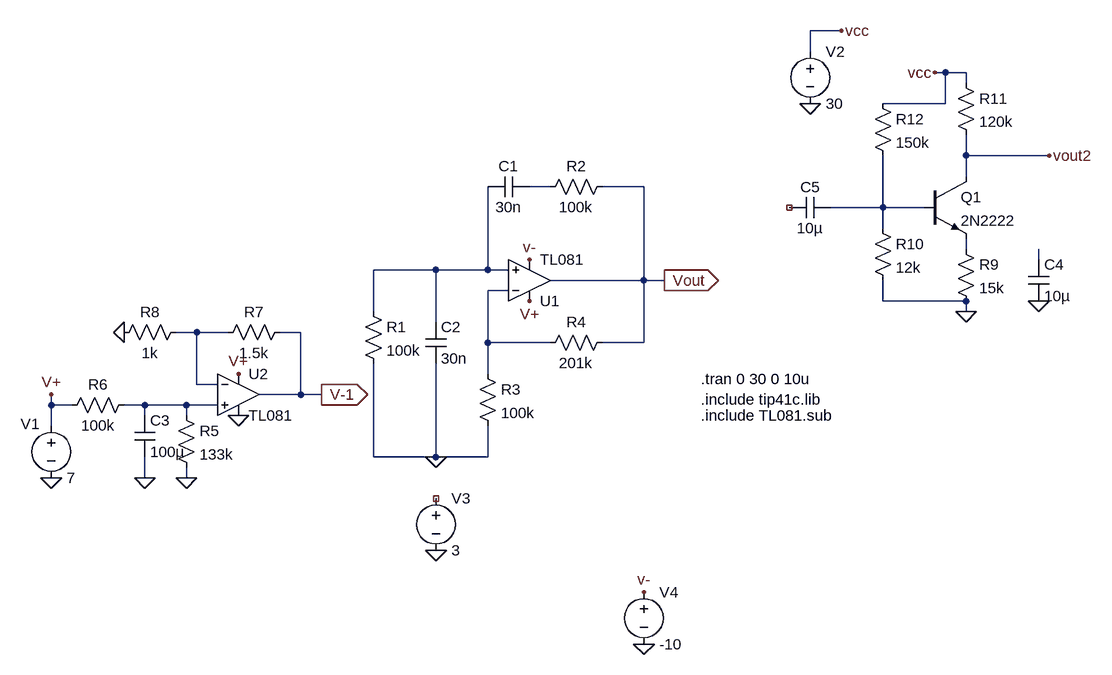
[diagram p0: schematic vib3_wein_bridge.asc]
vib3_wein_bridge.asc, the LTspice schematic file:
Version 4
SHEET 1 1540 680
WIRE 736 -512 688 -512
WIRE 688 -480 688 -512
WIRE 896 -448 880 -448
WIRE 928 -448 896 -448
WIRE 928 -432 928 -448
WIRE 896 -400 896 -448
WIRE 896 -400 800 -400
WIRE 928 -320 928 -352
WIRE 1056 -320 928 -320
WIRE 928 -288 928 -320
WIRE 288 -272 256 -272
WIRE 432 -272 368 -272
WIRE 800 -240 800 -320
WIRE 800 -240 720 -240
WIRE 864 -240 800 -240
WIRE 800 -208 800 -240
WIRE 928 -176 928 -192
WIRE 1040 -160 1040 -176
WIRE 112 -144 16 -144
WIRE 192 -144 192 -272
WIRE 192 -144 112 -144
WIRE 224 -144 192 -144
WIRE 432 -128 432 -272
WIRE 432 -128 288 -128
WIRE 464 -128 432 -128
WIRE 224 -112 192 -112
WIRE 800 -96 800 -128
WIRE 928 -96 800 -96
WIRE 16 -80 16 -144
WIRE 928 -80 928 -96
WIRE 112 -64 112 -144
WIRE -256 -48 -288 -48
WIRE -208 -48 -256 -48
WIRE -96 -48 -128 -48
WIRE 192 -32 192 -112
WIRE 288 -32 192 -32
WIRE 432 -32 432 -128
WIRE 432 -32 368 -32
WIRE 192 16 192 -32
WIRE -256 32 -256 -48
WIRE -224 32 -256 32
WIRE -96 48 -96 -48
WIRE -96 48 -160 48
WIRE -64 48 -96 48
WIRE -480 64 -480 48
WIRE -448 64 -480 64
WIRE -336 64 -368 64
WIRE -272 64 -336 64
WIRE -224 64 -272 64
WIRE -336 80 -336 64
WIRE -272 80 -272 64
WIRE -480 96 -480 64
WIRE 16 144 16 0
WIRE 112 144 112 0
WIRE 112 144 16 144
WIRE 192 144 192 96
WIRE 192 144 112 144
WIRE -336 176 -336 144
WIRE -272 176 -272 160
FLAG 464 -128 Vout
IOPIN 464 -128 Out
FLAG -480 48 V+
FLAG 256 -96 V+
FLAG -480 176 0
FLAG -272 176 0
FLAG 112 288 0
FLAG -64 48 V-1
IOPIN -64 48 Out
FLAG -192 16 V+
FLAG -192 80 0
FLAG -336 176 0
FLAG -368 -48 0
FLAG 688 -400 0
FLAG 736 -512 vcc
FLAG 880 -448 vcc
FLAG 928 -80 0
FLAG 1056 -320 vout2
FLAG 1040 -96 0
FLAG 432 432 0
FLAG 432 352 v-
FLAG 256 -160 v-
FLAG 112 144 0
SYMBOL res 0 -96 R0
SYMATTR InstName R1
SYMATTR Value 100k
SYMBOL res 384 -288 R90
WINDOW 0 0 56 VBottom 2
WINDOW 3 32 56 VTop 2
SYMATTR InstName R2
SYMATTR Value 100k
SYMBOL cap 256 -288 R90
WINDOW 0 0 32 VBottom 2
WINDOW 3 32 32 VTop 2
SYMATTR InstName C1
SYMATTR Value 30n
SYMBOL res 176 0 R0
SYMATTR InstName R3
SYMATTR Value 100k
SYMBOL res 384 -48 R90
WINDOW 0 0 56 VBottom 2
WINDOW 3 32 56 VTop 2
SYMATTR InstName R4
SYMATTR Value 201k
SYMBOL cap 96 -64 R0
SYMATTR InstName C2
SYMATTR Value 30n
SYMBOL voltage -480 80 R0
WINDOW 0 -47 13 Left 2
WINDOW 123 0 0 Left 0
WINDOW 39 0 0 Left 0
SYMATTR InstName V1
SYMATTR Value 7
SYMBOL OpAmps\\opamp2 256 -64 M180
SYMATTR InstName U1
SYMATTR Value TL081
SYMBOL res -288 64 R0
SYMATTR InstName R5
SYMATTR Value 133k
SYMBOL res -352 48 R90
WINDOW 0 0 56 VBottom 2
WINDOW 3 32 56 VTop 2
SYMATTR InstName R6
SYMATTR Value 100k
SYMBOL OpAmps\\opamp2 -192 -16 R0
SYMATTR InstName U2
SYMATTR Value TL081
SYMBOL voltage 112 192 R0
WINDOW 123 0 0 Left 0
WINDOW 39 0 0 Left 0
SYMATTR InstName V3
SYMATTR Value 3
SYMBOL cap -352 80 R0
SYMATTR InstName C3
SYMATTR Value 100µ
SYMBOL res -112 -64 R90
WINDOW 0 0 56 VBottom 2
WINDOW 3 32 56 VTop 2
SYMATTR InstName R7
SYMATTR Value 1.5k
SYMBOL res -272 -64 R90
WINDOW 0 0 56 VBottom 2
WINDOW 3 32 56 VTop 2
SYMATTR InstName R8
SYMATTR Value 1k
SYMBOL npn 864 -288 R0
SYMATTR InstName Q1
SYMATTR Value 2N2222
SYMBOL voltage 688 -496 R0
WINDOW 123 0 0 Left 0
WINDOW 39 0 0 Left 0
SYMATTR InstName V2
SYMATTR Value 30
SYMBOL res 912 -192 R0
SYMATTR InstName R9
SYMATTR Value 15k
SYMBOL res 912 -448 R0
SYMATTR InstName R11
SYMATTR Value 120k
SYMBOL res 784 -416 R0
SYMATTR InstName R12
SYMATTR Value 150k
SYMBOL res 784 -224 R0
SYMATTR InstName R10
SYMATTR Value 12k
SYMBOL cap 1024 -160 R0
SYMATTR InstName C4
SYMATTR Value 10µ
SYMBOL cap 720 -256 R90
WINDOW 0 0 32 VBottom 2
WINDOW 3 32 32 VTop 2
SYMATTR InstName C5
SYMATTR Value 10µ
SYMBOL voltage 432 336 R0
WINDOW 123 0 0 Left 0
WINDOW 39 0 0 Left 0
SYMATTR InstName V4
SYMATTR Value -10
TEXT 520 24 Left 2 !.tran 0 30 0 10u\n.include tip41c.lib
TEXT 520 80 Left 2 !.include TL081.sub

The netlist it stands for:
* vib3_wein_bridge.asc
R1 N005 0 100k
R2 Vout N001 100k
C1 N001 N005 30n
R3 N006 0 100k
R4 Vout N006 201k
C2 N005 0 30n
V1 V+ 0 7
XU1 N005 N006 V+ v- Vout TL081  ; pins In+ In- V+ V- OUT
R5 N008 0 133k
R6 N008 V+ 100k
XU2 N008 N007 V+ 0 V-1 TL081  ; pins In+ In- V+ V- OUT
V3 NC_01 0 3
C3 N008 0 100µ
R7 V-1 N007 1.5k
R8 N007 0 1k
Q1 vout2 N002 N003 0 2N2222
V2 vcc 0 30
R9 N003 0 15k
R11 vcc vout2 120k
R12 vcc N002 150k
R10 N002 0 12k
C4 N004 0 10µ
C5 N002 NC_02 10µ
V4 v- 0 -10
.model NPN NPN
.model PNP PNP
.lib standard.bjt
.tran 0 30 0 10u
.include tip41c.lib
.include TL081.sub
.backanno
.end